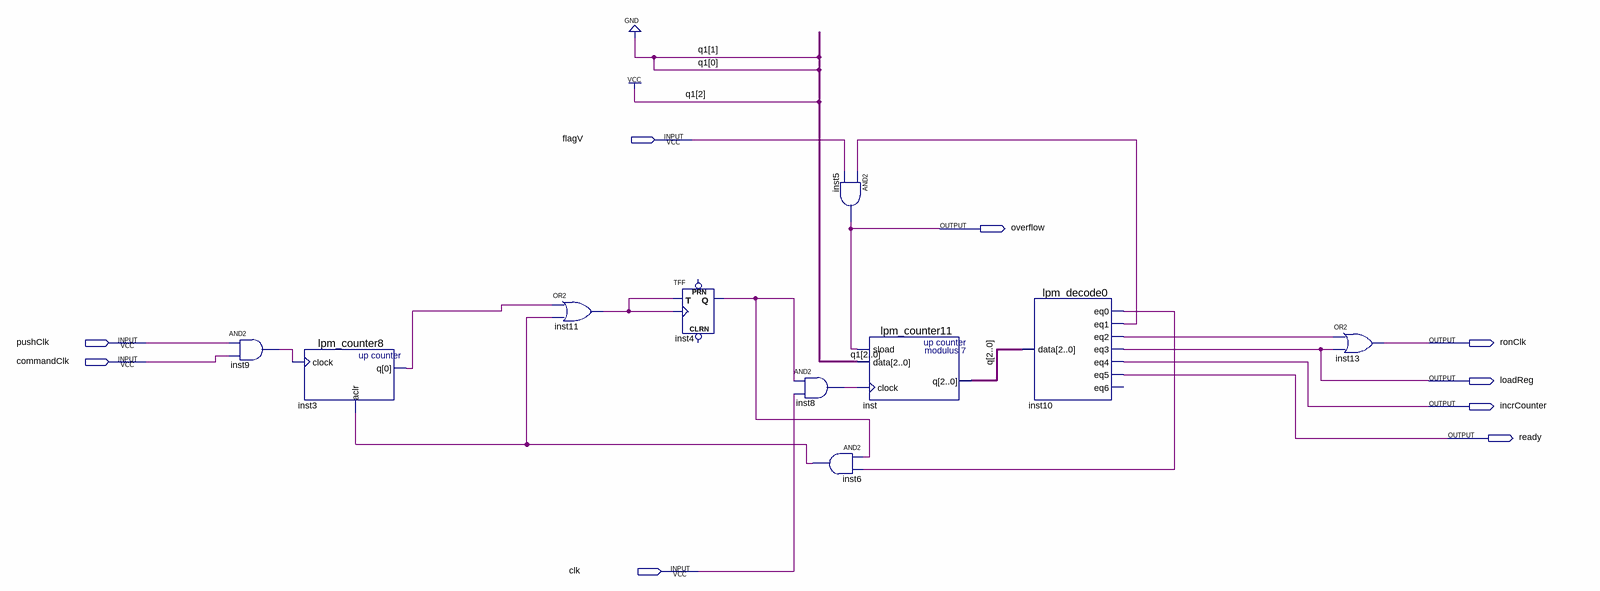
[diagram p0: schematic sheet]
// Quartus schematic push.bdf as structural Verilog: 10 symbols, 9 pins
module push (
  input  flagV,
  input  pushClk,
  input  commandClk,
  input  clk,
  output overflow,
  output ronClk,
  output loadReg,
  output incrCounter,
  output ready
);

  wire inst3_q, inst4_q, inst6_out, inst8_out, inst9_out, inst10_eq0, inst10_eq1, inst10_eq2, inst11_out;
  wire [2:0] q;

  and inst9 (inst9_out, pushClk, commandClk);
  lpm_counter8 inst3 (.clock(inst9_out), .aclr(inst6_out), .q(inst3_q));
  or inst11 (inst11_out, inst3_q, inst6_out);
  TFF inst4 (.T(inst11_out), .CLK(inst11_out), .Q(inst4_q));  // open: PRN, CLRN
  and inst8 (inst8_out, inst4_q, clk);
  and inst5 (overflow, inst10_eq1, flagV);
  lpm_counter11 inst (.sload(overflow), .data(3'b100), .clock(inst8_out), .q(q));
  and inst6 (inst6_out, inst4_q, inst10_eq0);
  lpm_decode0 inst10 (
    .data(q), .eq0(inst10_eq0), .eq1(inst10_eq1), .eq2(inst10_eq2), .eq3(loadReg), .eq4(incrCounter),
    .eq5(ready));  // open: eq6
  or inst13 (ronClk, inst10_eq2, loadReg);
endmodule
